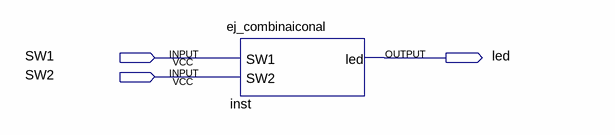
[diagram p0: schematic sheet]
// Quartus schematic Block1.bdf as structural Verilog: 1 symbols, 3 pins
module Block1 (
  input  SW1,
  input  SW2,
  output led
);

  ej_combinaiconal inst (.SW1(SW1), .SW2(SW2), .led(led));
endmodule
